# EAGLE design 12_lead_ecg_prototype_1 (EAGLE 9.6.1)
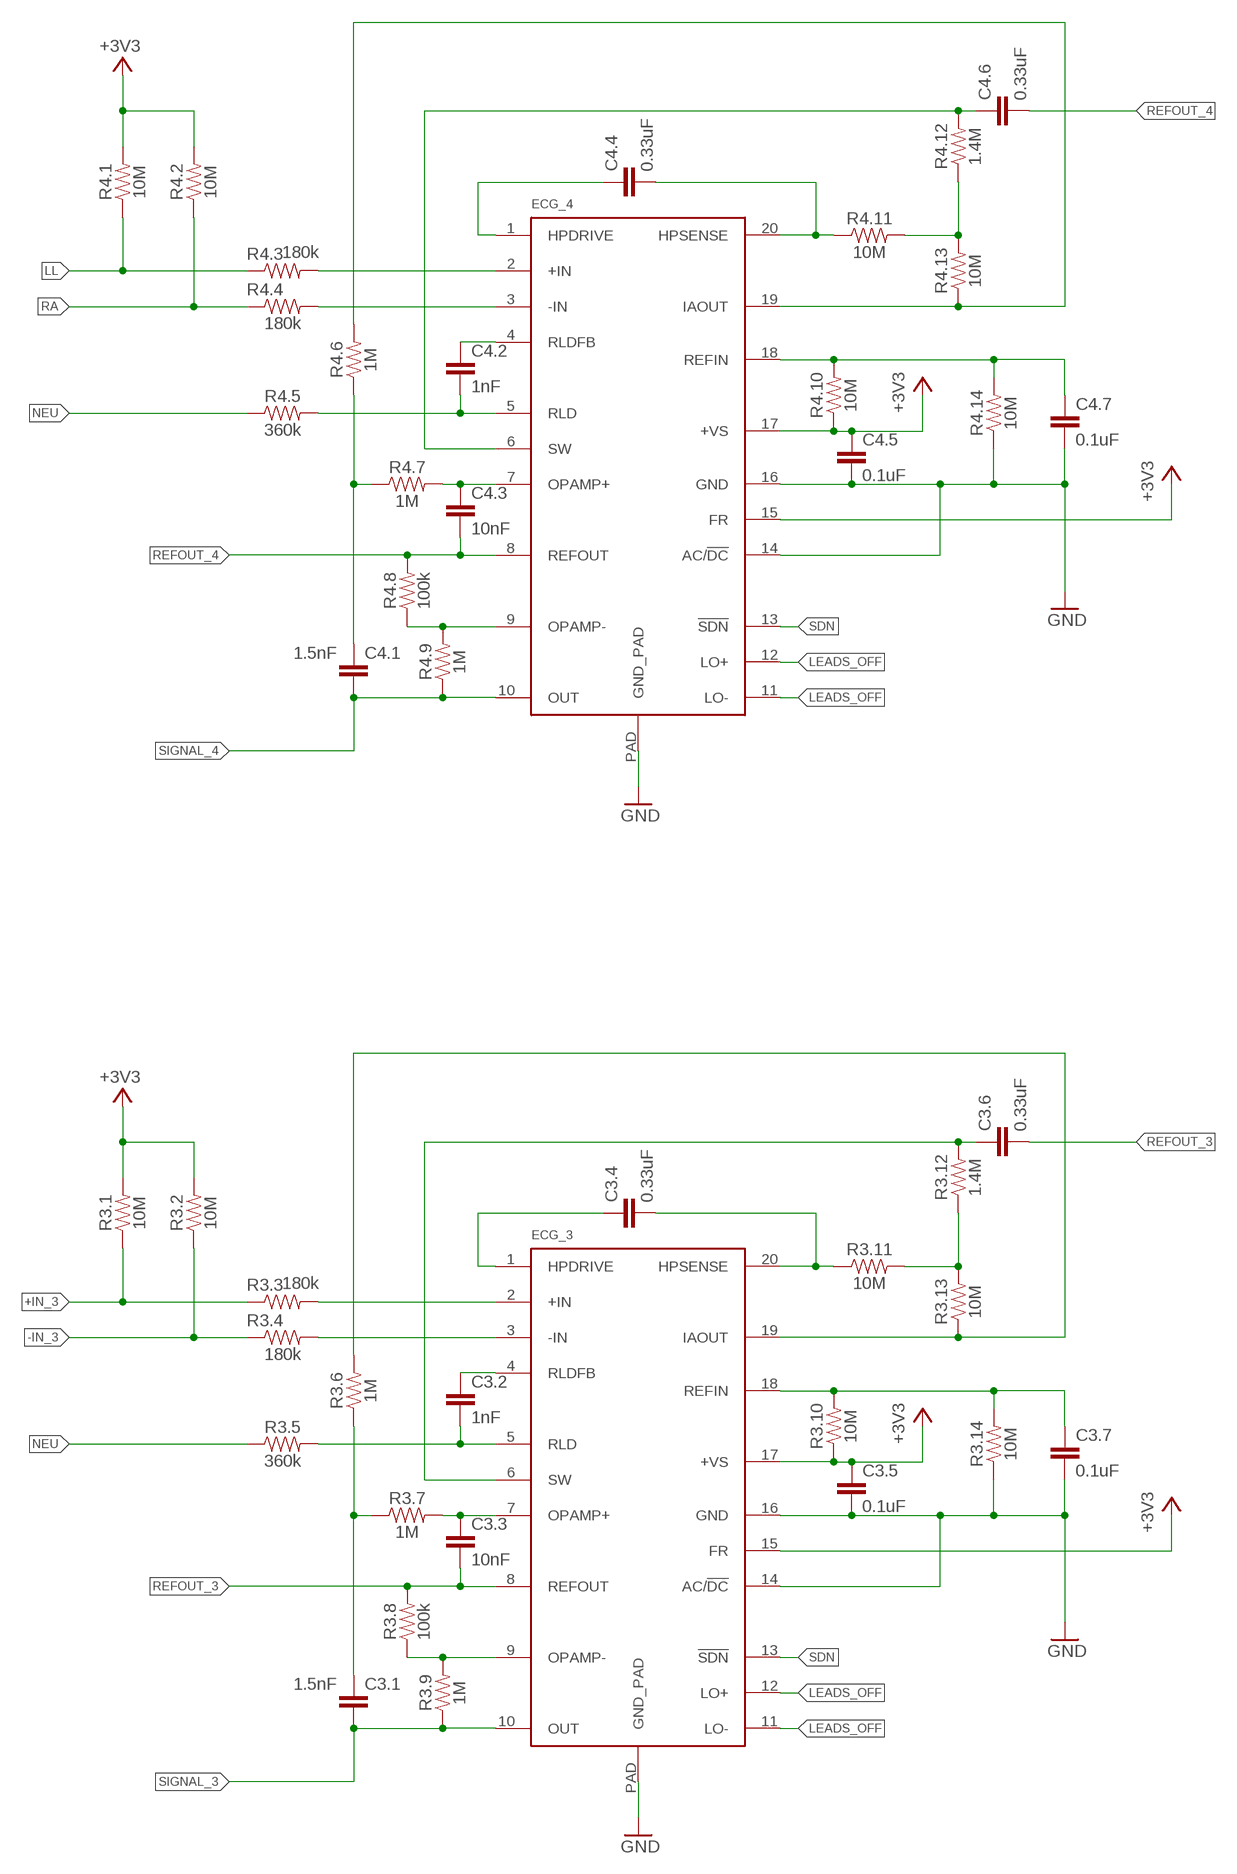
[diagram p0: schematic, sheet 1, part 1 of 2]
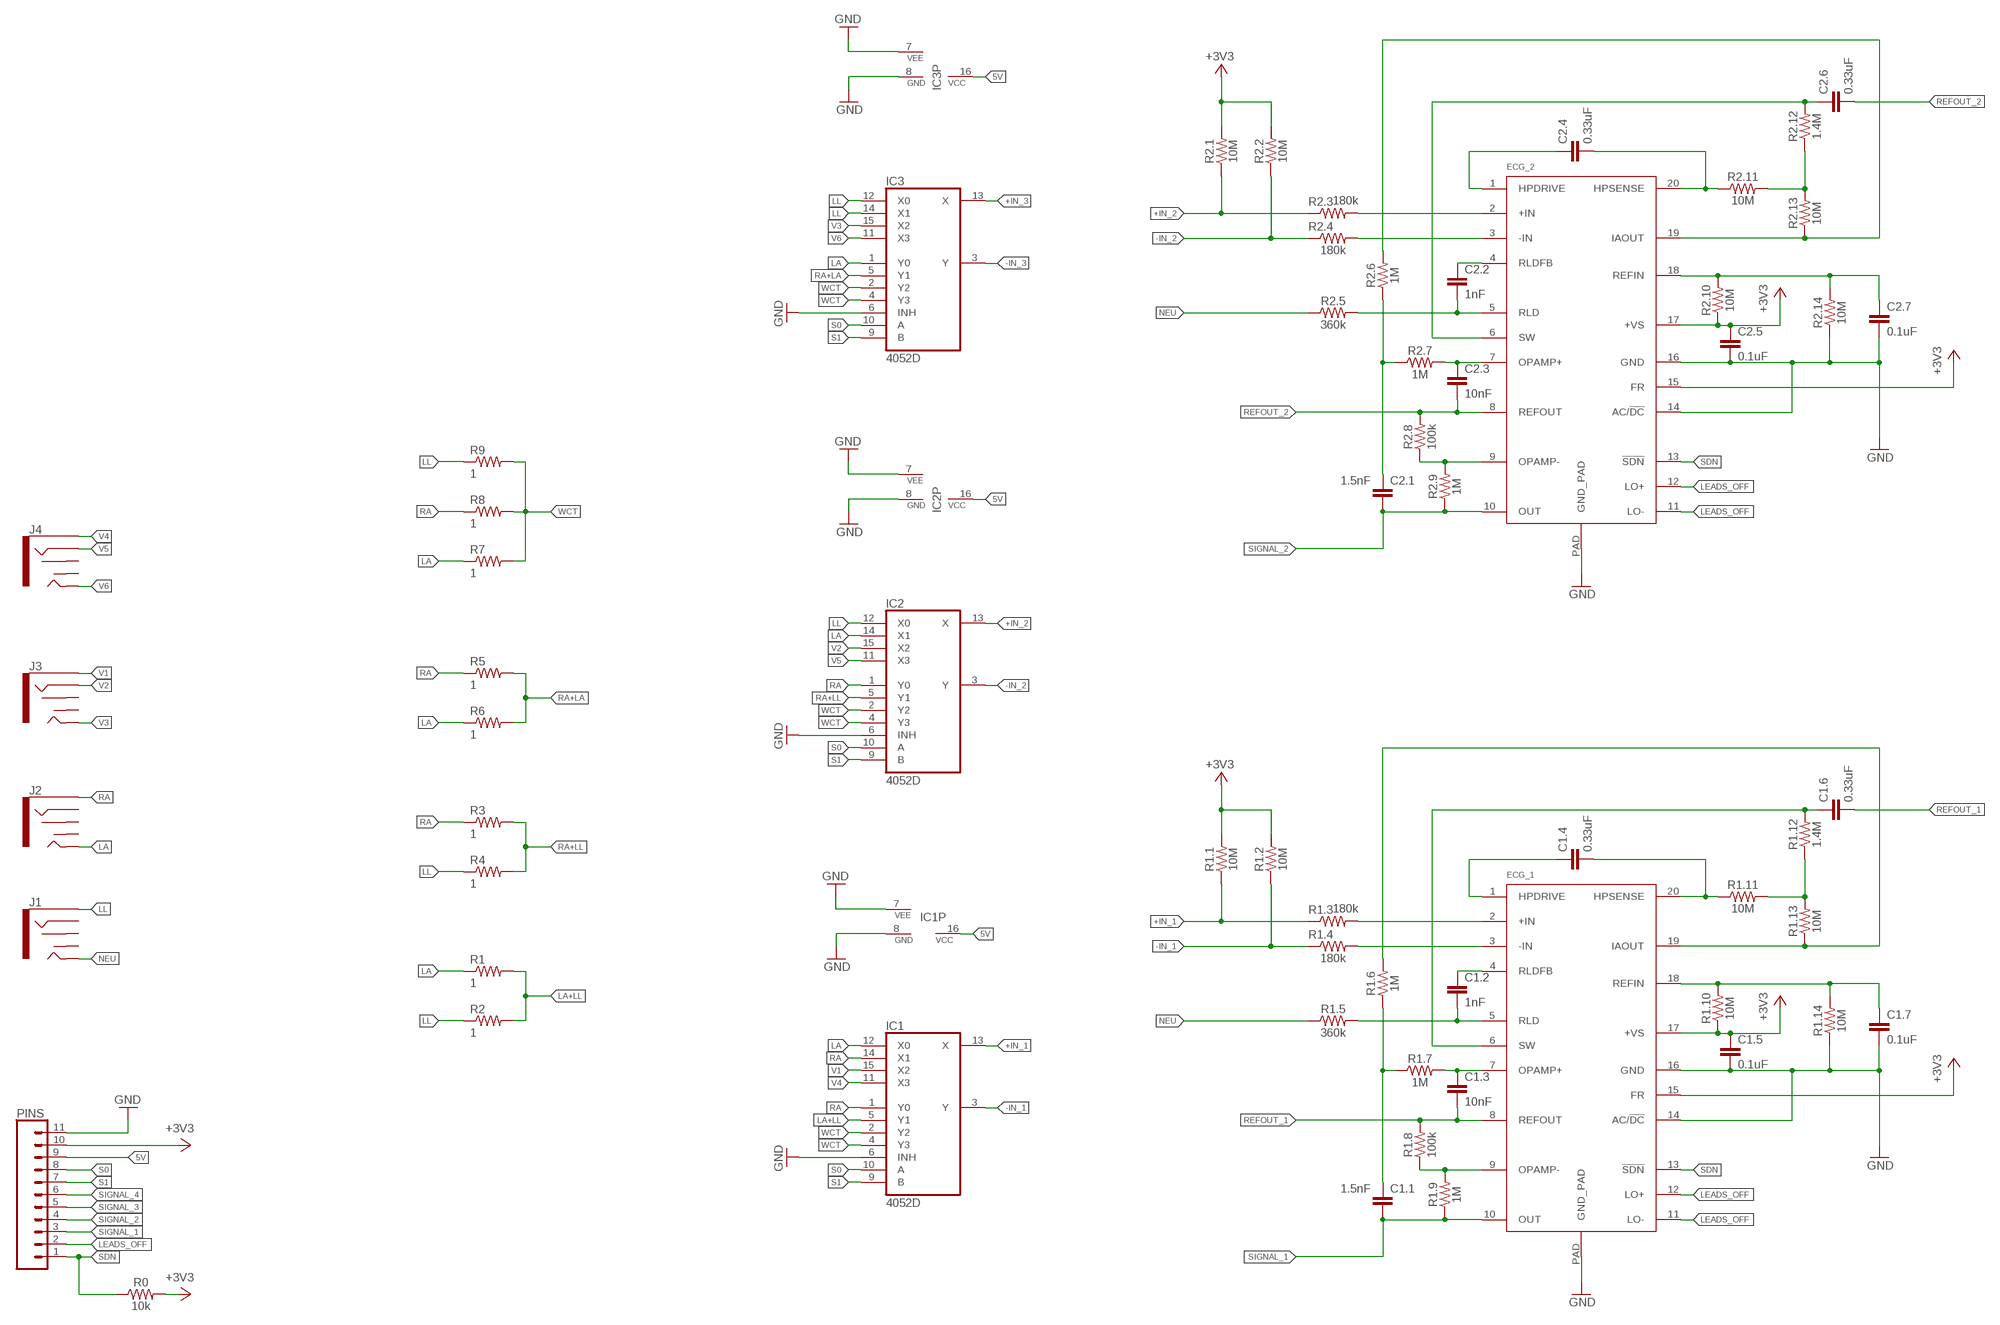
[diagram p1: schematic, sheet 1, part 2 of 2]

## Parts
C1.1  1.5nF  CAP0603-CAP  [0603-CAP]
C1.2  1nF  CAP0603-CAP  [0603-CAP]
C1.3  10nF  CAP0603-CAP  [0603-CAP]
C1.4  0.33uF  CAP0805  [0805]
C1.5  0.1uF  CAP0603-CAP  [0603-CAP]
C1.6  0.33uF  CAP0805  [0805]
C1.7  0.1uF  CAP0603-CAP  [0603-CAP]
C2.1  1.5nF  CAP0603-CAP  [0603-CAP]
C2.2  1nF  CAP0603-CAP  [0603-CAP]
C2.3  10nF  CAP0603-CAP  [0603-CAP]
C2.4  0.33uF  CAP0805  [0805]
C2.5  0.1uF  CAP0603-CAP  [0603-CAP]
C2.6  0.33uF  CAP0805  [0805]
C2.7  0.1uF  CAP0603-CAP  [0603-CAP]
C3.1  1.5nF  CAP0603-CAP  [0603-CAP]
C3.2  1nF  CAP0603-CAP  [0603-CAP]
C3.3  10nF  CAP0603-CAP  [0603-CAP]
C3.4  0.33uF  CAP0805  [0805]
C3.5  0.1uF  CAP0603-CAP  [0603-CAP]
C3.6  0.33uF  CAP0805  [0805]
C3.7  0.1uF  CAP0603-CAP  [0603-CAP]
C4.1  1.5nF  CAP0603-CAP  [0603-CAP]
C4.2  1nF  CAP0603-CAP  [0603-CAP]
C4.3  10nF  CAP0603-CAP  [0603-CAP]
C4.4  0.33uF  CAP0805  [0805]
C4.5  0.1uF  CAP0603-CAP  [0603-CAP]
C4.6  0.33uF  CAP0805  [0805]
C4.7  0.1uF  CAP0603-CAP  [0603-CAP]
ECG_1  AD8232ACPZ-R7  AD8232  [LFCSP_20]
ECG_2  AD8232ACPZ-R7  AD8232  [LFCSP_20]
ECG_3  AD8232ACPZ-R7  AD8232  [LFCSP_20]
ECG_4  AD8232ACPZ-R7  AD8232  [LFCSP_20]
IC1  4052D  [SO16]
IC2  4052D  [SO16]
IC3  4052D  [SO16]
J1  AUDIO_JACK_3.5MM_SMD  [AUDIO-JACK-3.5MM-SMD]
J2  AUDIO_JACK_3.5MM_SMD  [AUDIO-JACK-3.5MM-SMD]
J3  AUDIO_JACK_3.5MM_SMD  [AUDIO-JACK-3.5MM-SMD]
J4  AUDIO_JACK_3.5MM_SMD  [AUDIO-JACK-3.5MM-SMD]
PINS  CONN_11  [1X11]
R0  10k  10KOHM-0603-1/10W-1%  [0603]
R1  1  RESISTOR0402-RES  [0402-RES]
R1.1  10M  RESISTOR0603  [0603]
R1.2  10M  RESISTOR0603  [0603]
R1.3  180k  RESISTOR0603  [0603]
R1.4  180k  RESISTOR0603  [0603]
R1.5  360k  RESISTOR0603  [0603]
R1.6  1M  RESISTOR0603  [0603]
R1.7  1M  RESISTOR0603  [0603]
R1.8  100k  RESISTOR0603  [0603]
R1.9  1M  RESISTOR0603  [0603]
R1.10  10M  RESISTOR0603  [0603]
R1.11  10M  RESISTOR0603  [0603]
R1.12  1.4M  RESISTOR0603  [0603]
R1.13  10M  RESISTOR0603  [0603]
R1.14  10M  RESISTOR0603  [0603]
R2  1  RESISTOR0402-RES  [0402-RES]
R2.1  10M  RESISTOR0603  [0603]
R2.2  10M  RESISTOR0603  [0603]
R2.3  180k  RESISTOR0603  [0603]
R2.4  180k  RESISTOR0603  [0603]
R2.5  360k  RESISTOR0603  [0603]
R2.6  1M  RESISTOR0603  [0603]
R2.7  1M  RESISTOR0603  [0603]
R2.8  100k  RESISTOR0603  [0603]
R2.9  1M  RESISTOR0603  [0603]
R2.10  10M  RESISTOR0603  [0603]
R2.11  10M  RESISTOR0603  [0603]
R2.12  1.4M  RESISTOR0603  [0603]
R2.13  10M  RESISTOR0603  [0603]
R2.14  10M  RESISTOR0603  [0603]
R3  1  RESISTOR0402-RES  [0402-RES]
R3.1  10M  RESISTOR0603  [0603]
R3.2  10M  RESISTOR0603  [0603]
R3.3  180k  RESISTOR0603  [0603]
R3.4  180k  RESISTOR0603  [0603]
R3.5  360k  RESISTOR0603  [0603]
R3.6  1M  RESISTOR0603  [0603]
R3.7  1M  RESISTOR0603  [0603]
R3.8  100k  RESISTOR0603  [0603]
R3.9  1M  RESISTOR0603  [0603]
R3.10  10M  RESISTOR0603  [0603]
R3.11  10M  RESISTOR0603  [0603]
R3.12  1.4M  RESISTOR0603  [0603]
R3.13  10M  RESISTOR0603  [0603]
R3.14  10M  RESISTOR0603  [0603]
R4  1  RESISTOR0402-RES  [0402-RES]
R4.1  10M  RESISTOR0603  [0603]
R4.2  10M  RESISTOR0603  [0603]
R4.3  180k  RESISTOR0603  [0603]
R4.4  180k  RESISTOR0603  [0603]
R4.5  360k  RESISTOR0603  [0603]
R4.6  1M  RESISTOR0603  [0603]
R4.7  1M  RESISTOR0603  [0603]
R4.8  100k  RESISTOR0603  [0603]
R4.9  1M  RESISTOR0603  [0603]
R4.10  10M  RESISTOR0603  [0603]
R4.11  10M  RESISTOR0603  [0603]
R4.12  1.4M  RESISTOR0603  [0603]
R4.13  10M  RESISTOR0603  [0603]
R4.14  10M  RESISTOR0603  [0603]
R5  1  RESISTOR0402-RES  [0402-RES]
R6  1  RESISTOR0402-RES  [0402-RES]
R7  1  RESISTOR0402-RES  [0402-RES]
R8  1  RESISTOR0402-RES  [0402-RES]
R9  1  RESISTOR0402-RES  [0402-RES]

## Nets
5V: IC1.16(VCC) IC2.16(VCC) IC3.16(VCC) PINS.9
+3V3: C1.5.1 C2.5.1 C3.5.1 C4.5.1 ECG_1.15(FR) ECG_1.17(+VS) ECG_2.15(FR) ECG_2.17(+VS) ECG_3.15(FR) ECG_3.17(+VS) ECG_4.15(FR) ECG_4.17(+VS) PINS.10 R0.2 R1.1.2 R1.2.2 R1.10.1 R2.1.2 R2.2.2 R2.10.1 R3.1.2 R3.2.2 R3.10.1 R4.1.2 R4.2.2 R4.10.1
+IN_1: IC1.13(X) R1.1.1 R1.3.1
+IN_2: IC2.13(X) R2.1.1 R2.3.1
+IN_3: IC3.13(X) R3.1.1 R3.3.1
-IN_1: IC1.3(Y) R1.2.1 R1.4.1
-IN_2: IC2.3(Y) R2.2.1 R2.4.1
-IN_3: IC3.3(Y) R3.2.1 R3.4.1
GND: C1.5.2 C1.7.2 C2.5.2 C2.7.2 C3.5.2 C3.7.2 C4.5.2 C4.7.2 ECG_1.14(AC/!DC) ECG_1.16(GND) ECG_1.PAD(GND_PAD) ECG_2.14(AC/!DC) ECG_2.16(GND) ECG_2.PAD(GND_PAD) ECG_3.14(AC/!DC) ECG_3.16(GND) ECG_3.PAD(GND_PAD) ECG_4.14(AC/!DC) ECG_4.16(GND) ECG_4.PAD(GND_PAD) IC1.6(INH) IC1.7(VEE) IC1.8(GND) IC2.6(INH) IC2.7(VEE) IC3.6(INH) IC3.7(VEE) PINS.11 R1.14.1 R2.14.1 R3.14.1 R4.14.1
LA: IC1.12(X0) IC2.14(X1) IC3.1(Y0) J2.TIP R1.1 R6.1 R7.1
LA+LL: IC1.5(Y1) R1.2 R2.2
LEADS_OFF: ECG_1.11(LO-) ECG_1.12(LO+) ECG_2.11(LO-) ECG_2.12(LO+) ECG_3.11(LO-) ECG_3.12(LO+) ECG_4.11(LO-) ECG_4.12(LO+) PINS.2
LL: IC2.12(X0) IC3.12(X0) IC3.14(X1) J1.SLEEVE R2.1 R4.1 R4.1.1 R4.3.1 R9.1
N$1: ECG_1.9(OPAMP-) R1.8.1 R1.9.2
N$2: ECG_2.2(+IN) R2.3.2
N$3: ECG_1.2(+IN) R1.3.2
N$4: ECG_1.3(-IN) R1.4.2
N$5: ECG_2.3(-IN) R2.4.2
N$6: C1.1.1 R1.6.1 R1.7.1
N$7: C1.3.1 ECG_1.7(OPAMP+) R1.7.2
N$8: C1.2.1 ECG_1.4(RLDFB)
N$9: C1.2.2 ECG_1.5(RLD) R1.5.2
N$10: ECG_1.19(IAOUT) R1.6.2 R1.13.1
N$11: C1.6.1 ECG_1.6(SW) R1.12.2
N$12: C1.7.1 ECG_1.18(REFIN) R1.10.2 R1.14.2
N$13: R1.11.2 R1.12.1 R1.13.2
N$14: C1.4.2 ECG_1.20(HPSENSE) R1.11.1
N$15: C1.4.1 ECG_1.1(HPDRIVE)
N$16: C2.2.1 ECG_2.4(RLDFB)
N$17: C2.2.2 ECG_2.5(RLD) R2.5.2
N$18: IC2.8(GND) IC3.8(GND) ; supply symbol labelled GND
N$19: C2.1.1 R2.6.1 R2.7.1
N$20: C2.3.1 ECG_2.7(OPAMP+) R2.7.2
N$21: ECG_2.9(OPAMP-) R2.8.1 R2.9.2
N$22: ECG_2.19(IAOUT) R2.6.2 R2.13.1
N$23: C2.6.1 ECG_2.6(SW) R2.12.2
N$24: R2.11.2 R2.12.1 R2.13.2
N$25: C2.4.2 ECG_2.20(HPSENSE) R2.11.1
N$26: C2.4.1 ECG_2.1(HPDRIVE)
N$27: C2.7.1 ECG_2.18(REFIN) R2.10.2 R2.14.2
N$28: ECG_3.2(+IN) R3.3.2
N$29: ECG_3.3(-IN) R3.4.2
N$30: C3.2.1 ECG_3.4(RLDFB)
N$31: C3.2.2 ECG_3.5(RLD) R3.5.2
N$32: C3.1.1 R3.6.1 R3.7.1
N$33: C3.3.1 ECG_3.7(OPAMP+) R3.7.2
N$34: ECG_3.9(OPAMP-) R3.8.1 R3.9.2
N$35: ECG_3.19(IAOUT) R3.6.2 R3.13.1
N$36: C3.6.1 ECG_3.6(SW) R3.12.2
N$37: R3.11.2 R3.12.1 R3.13.2
N$38: C3.4.2 ECG_3.20(HPSENSE) R3.11.1
N$39: C3.4.1 ECG_3.1(HPDRIVE)
N$40: C3.7.1 ECG_3.18(REFIN) R3.10.2 R3.14.2
N$41: ECG_4.2(+IN) R4.3.2
N$42: ECG_4.3(-IN) R4.4.2
N$43: C4.2.1 ECG_4.4(RLDFB)
N$44: C4.2.2 ECG_4.5(RLD) R4.5.2
N$45: C4.1.1 R4.6.1 R4.7.1
N$46: C4.3.1 ECG_4.7(OPAMP+) R4.7.2
N$47: ECG_4.9(OPAMP-) R4.8.1 R4.9.2
N$48: ECG_4.19(IAOUT) R4.6.2 R4.13.1
N$49: C4.6.1 ECG_4.6(SW) R4.12.2
N$50: R4.11.2 R4.12.1 R4.13.2
N$51: C4.4.2 ECG_4.20(HPSENSE) R4.11.1
N$52: C4.4.1 ECG_4.1(HPDRIVE)
N$53: C4.7.1 ECG_4.18(REFIN) R4.10.2 R4.14.2
NEU: J1.TIP R1.5.1 R2.5.1 R3.5.1 R4.5.1
RA: IC1.1(Y0) IC1.14(X1) IC2.1(Y0) J2.SLEEVE R3.1 R4.2.1 R4.4.1 R5.1 R8.1
RA+LA: IC3.5(Y1) R5.2 R6.2
RA+LL: IC2.5(Y1) R3.2 R4.2
REFOUT_1: C1.3.2 C1.6.2 ECG_1.8(REFOUT) R1.8.2
REFOUT_2: C2.3.2 C2.6.2 ECG_2.8(REFOUT) R2.8.2
REFOUT_3: C3.3.2 C3.6.2 ECG_3.8(REFOUT) R3.8.2
REFOUT_4: C4.3.2 C4.6.2 ECG_4.8(REFOUT) R4.8.2
S0: IC1.10(A) IC2.10(A) IC3.10(A) PINS.8
S1: IC1.9(B) IC2.9(B) IC3.9(B) PINS.7
SDN: ECG_1.13(!SDN) ECG_2.13(!SDN) ECG_3.13(!SDN) ECG_4.13(!SDN) PINS.1 R0.1
SIGNAL_1: C1.1.2 ECG_1.10(OUT) PINS.3 R1.9.1
SIGNAL_2: C2.1.2 ECG_2.10(OUT) PINS.4 R2.9.1
SIGNAL_3: C3.1.2 ECG_3.10(OUT) PINS.5 R3.9.1
SIGNAL_4: C4.1.2 ECG_4.10(OUT) PINS.6 R4.9.1
V1: IC1.15(X2) J3.SLEEVE
V2: IC2.15(X2) J3.RING
V3: IC3.15(X2) J3.TIP
V4: IC1.11(X3) J4.SLEEVE
V5: IC2.11(X3) J4.RING
V6: IC3.11(X3) J4.TIP
WCT: IC1.2(Y2) IC1.4(Y3) IC2.2(Y2) IC2.4(Y3) IC3.2(Y2) IC3.4(Y3) R7.2 R8.2 R9.2
Unconnected: J1.RING J1.RSH J1.TSH J2.RING J2.RSH J2.TSH J3.RSH J3.TSH J4.RSH J4.TSH

## Library data of the parts
C1.1-C1.7 C2.1-C2.7 C3.1-C3.7 C4.1-C4.7 = SparkFun-Passives:CAP: Capacitor Standard 0603 ceramic capacitor, and 0.1" leaded capacitor.
ECG_1-ECG_4 = SparkFun-Sensors:AD8232: AD8232 Single Lead Heart Rate Monitor IC Datasheet <https://cdn.sparkfun.com/datasheets/Sensors/Biometric/AD8232.pdf> SparkFun Products SparkFun Single Lead Heart Rate Monitor - AD8232 <https://www.sparkfun.com/products/12650> (SEN-12650); PROD_ID: IC-11886
IC1-IC3 = 40xx:4052: Dual 4-channel ANALOG MULTIPLEXER
J1-J4 = SparkFun-Connectors:AUDIO_JACK_3.5MM: Audio Jack 3.5mm variants of PTH and SMT stereo audio jack with bypass switches. SparkFun Products: SparkFun SparkPunk Sound Kit <[https://www.sparkfun.com/products/11177]> - PTH MP3 Trigger <https://www.sparkfun.com/products/13720> -3.5mm SMD SparkFun PicoBoard <https://www.sparkfun.com/products/11888>- 2.5mm SMD; PROD_ID: CONN-10353
PINS = SparkFun-Connectors:CONN_11: Multi connection point. Often used as Generic Header-pin footprint for 0.1 inch spaced/style header connections On any of the 0.1 inch spaced packages, you can populate with these: Break Away Headers - Straight <https://www.sparkfun.com/products/116> (PRT-00116) Break Away Male Headers - Right Angle <https://www.sparkfun.com/products/553> (PRT-00553) Female Headers <https://www.sparkfun.com/products/115> (PRT-00115) Break Away Headers - Machine Pin <https://www.sparkfun.com/products/117> (PRT-00117) Break Away Female Headers - Swiss Machine Pin <https://www.sparkfun.com/products/743> (PRT-00743) For SCREWTERMINALS and SPRING TERMINALS visit here: Screw Terimnals on SparkFun.com <https://www.sparkfun.com/search/results?term=Screw+Terminals> (5mm/3.5mm/2.54mm spacing) This device is also useful as a general connection point to wire up your design to another part of your project. Our various solder wires solder well into these plated through hole pads. Hook-Up Wire - Assortment (Stranded, 22 AWG) <https://www.sparkfun.com/products/11375> (PRT-11375) Hook-Up Wire - Assortment (Solid Core, 22 AWG) <https://www.sparkfun.com/products/11367> (PRT-11367) View the entire wire category on our website here <https://www.sparkfun.com/categories/141>
R0 = SparkFun-Resistors:10KOHM: 10kΩ resistor A resistor is a passive two-terminal electrical component that implements electrical resistance as a circuit element. Resistors act to reduce current flow, and, at the same time, act to lower voltage levels within circuits. - Wikipedia; PROD_ID: RES-00824
R1-R9 = SparkFun:RESISTOR: Resistor Basic schematic elements and footprints for 0603, 1206, and PTH resistors.
R1.1-R1.14 R2.1-R2.14 R3.1-R3.14 R4.1-R4.14 = SparkFun-Resistors:RESISTOR: Generic Resistor Package

## Board
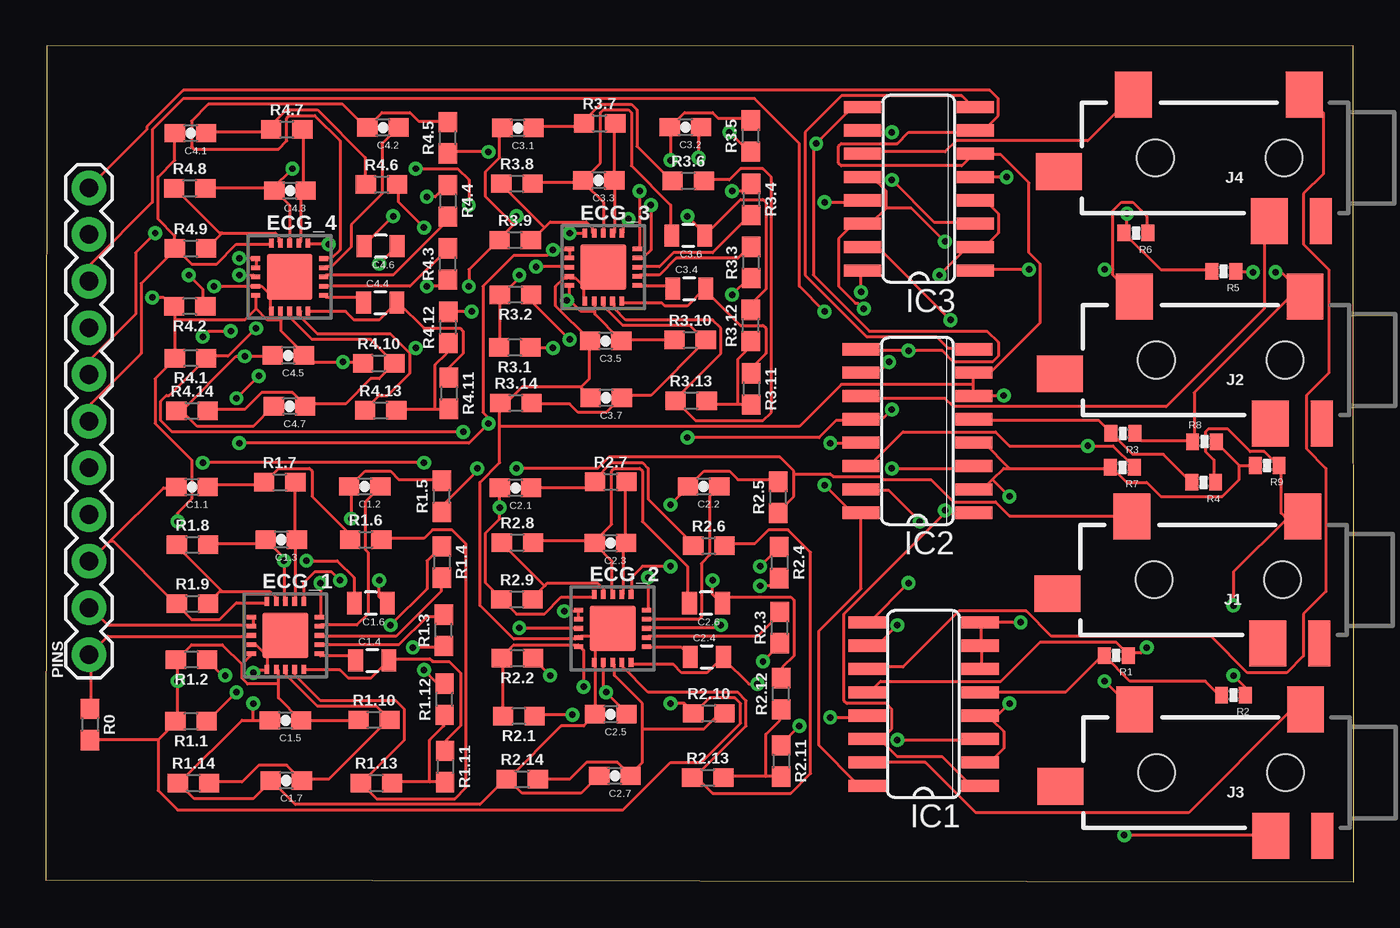
[diagram p2: board, top side]
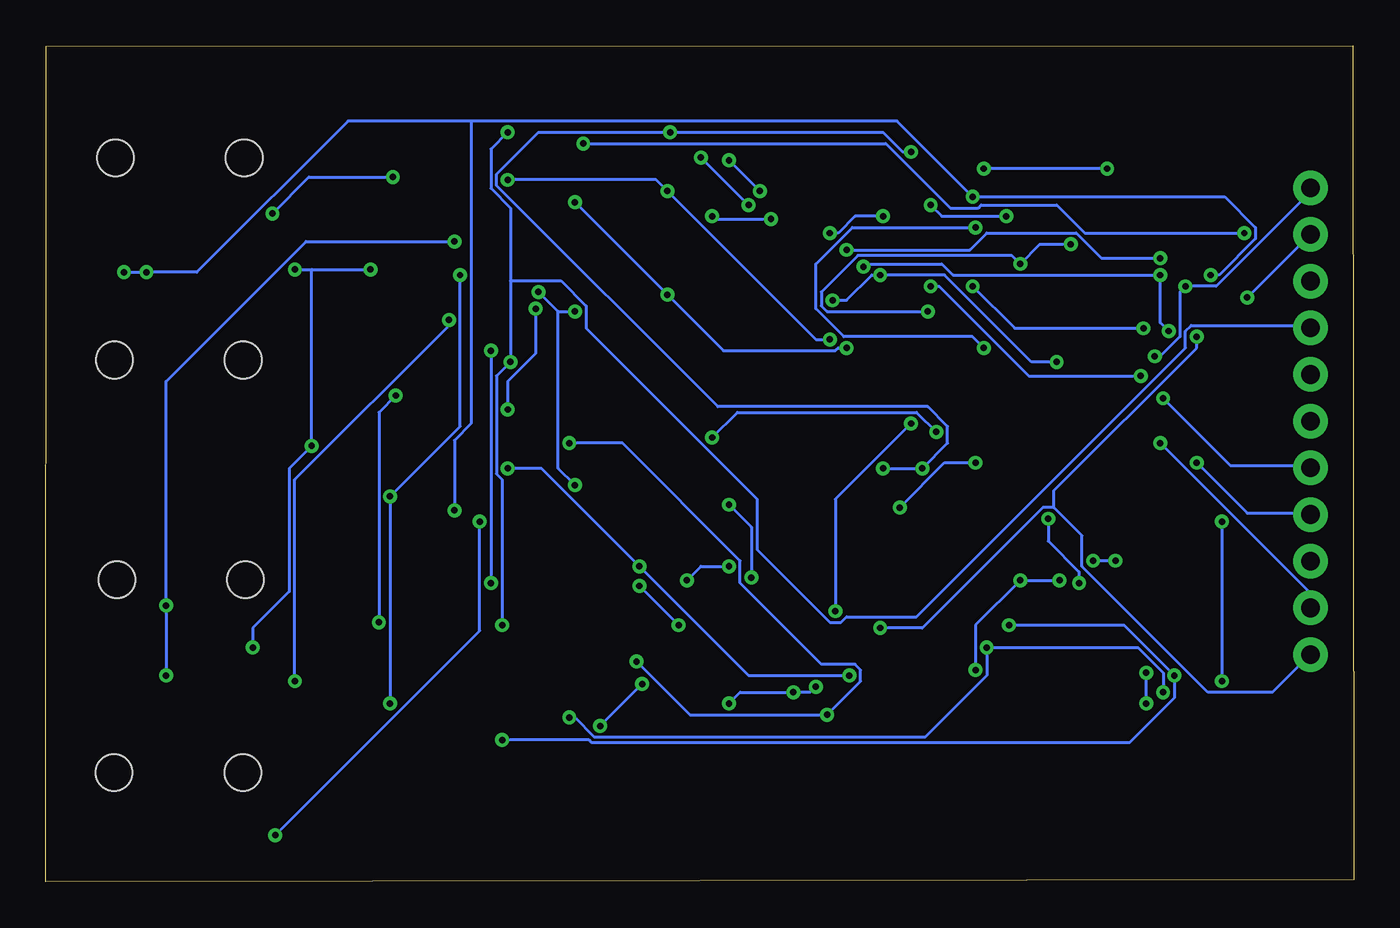
[diagram p3: board, bottom side, seen from below]

Size 71.15 x 45.49 mm. Coordinates in mm from the lower left corner, seen from the top.
Outline: 0,0.1 71.15,0 71.12,45.47 0.05,45.49 0,0.1
Copper layers (1*16): Top 0.035mm / dielectric 1.5mm / Bottom 0.035mm
Design rules "default": minimum track width 6mil, minimum drill 0.35mm, track to track 6mil, track to pad 6mil, pad to pad 6mil, via to via 6mil, smd to smd 6mil, copper to edge 40mil, drill to drill 6mil, minimum pad ring 10mil, minimum via ring 8mil, stop-mask expansion 4mil, vias tented up to drill 0mil, thermal gap 10mil

### Footprints (pad centres in the part's own frame; a part is rotated, then mirrored left to right if it is on the bottom)
0603-CAP = smd 1.1 x 1: 1 -0.85,0; 2 0.85,0
0805 = smd 0.8 x 1.2: 1 -0.9,0; 2 0.9,0
LFCSP_20 = smd 0.5 x 0.25: 1 -1.85,1; 2 -1.85,0.5; 3 -1.85,0; 4 -1.85,-0.5; 5 -1.85,-1; 11 1.85,-1; 12 1.85,-0.5; 13 1.85,0; 14 1.85,0.5; 15 1.85,1 | smd 0.25 x 0.5: 6 -1,-1.85; 7 -0.5,-1.85; 8 0,-1.85; 9 0.5,-1.85; 10 1,-1.85; 16 1,1.85; 17 0.5,1.85; 18 0,1.85; 19 -0.5,1.85; 20 -1,1.85 | smd 2.5 x 2.5: PAD 0,0
SO16 = smd 0.66 x 2.032: 1 -4.445,-3.073; 2 -3.175,-3.073; 3 -1.905,-3.073; 4 -0.635,-3.073; 5 0.635,-3.073; 6 1.905,-3.073; 7 3.175,-3.073; 8 4.445,-3.073; 9 4.445,3.073; 10 3.175,3.073; 11 1.905,3.073; 12 0.635,3.073; 13 -0.635,3.073; 14 -1.905,3.073; 15 -3.175,3.073; 16 -4.445,3.073
AUDIO-JACK-3.5MM-SMD = smd 2 x 2.5: RING 4.3,3.45; SLEEVE 2.4,-3.45; TIP 11.7,-3.45 | smd 1.2 x 2.5: RSH 1.5,3.45 | smd 2.5 x 2: TSH 15.75,0.75 | hole 2: 3.5,0; 10.5,0
1X11 = drill 1.016 pad 1.88: 1 0,0; 2 2.54,0; 3 5.08,0; 4 7.62,0; 5 10.16,0; 6 12.7,0; 7 15.24,0; 8 17.78,0; 9 20.32,0; 10 22.86,0; 11 25.4,0
0603 = smd 1.1 x 1: 1 -0.85,0; 2 0.85,0
0402-RES = smd 0.7 x 0.9: 1 -0.65,0; 2 0.65,0

### Placement (x,y rotation side)
C1.1  7.95,21.49 180 top
C1.2  17.35,21.51 180 top
C1.3  12.8,18.62 180 top
C1.4  17.75,12.04 0 top
C1.5  13.03,8.79 180 top
C1.6  17.68,15.16 180 top
C1.7  13.08,5.51 180 top
C2.1  25.55,21.44 180 top
C2.2  35.79,21.51 180 top
C2.3  30.71,18.44 180 top
C2.4  35.97,12.24 0 top
C2.5  30.73,9.12 180 top
C2.6  35.92,15.16 180 top
C2.7  30.96,5.77 180 top
C3.1  25.68,41.02 180 top
C3.2  34.8,41.07 180 top
C3.3  30.07,38.18 180 top
C3.4  35,32.28 0 top
C3.5  30.45,29.44 180 top
C3.6  34.95,35.18 180 top
C3.7  30.48,26.34 180 top
C4.1  7.87,40.74 180 top
C4.2  18.34,41.05 180 top
C4.3  13.28,37.62 180 top
C4.4  18.19,31.52 0 top
C4.5  13.18,28.65 180 top
C4.6  18.21,34.59 180 top
C4.7  13.26,25.88 180 top
ECG_1  13.03,13.41 180 top
ECG_2  30.84,13.79 180 top
ECG_3  30.33,33.45 180 top
ECG_4  13.26,32.92 180 top
IC1  47.75,9.68 90 top
IC2  47.42,24.54 90 top
IC3  47.5,37.72 90 top
J1  70.79,16.43 180 top
J2  70.92,28.4 180 top
J3  70.94,5.94 180 top
J4  70.87,39.4 180 top
PINS  2.34,12.37 90 top
R0  2.39,8.56 270 top
R1  58.24,12.32 180 top
R1.1  7.9,8.74 180 top
R1.2  7.92,12.09 180 top
R1.3  21.64,13.69 90 top
R1.4  21.54,17.4 270 top
R1.5  21.54,20.98 90 top
R1.6  17.4,18.62 0 top
R1.7  12.73,21.74 0 top
R1.8  7.98,18.34 0 top
R1.9  7.98,15.14 0 top
R1.10  17.86,8.81 0 top
R1.11  21.72,6.27 270 top
R1.12  21.69,9.93 90 top
R1.13  17.98,5.38 0 top
R1.14  8.03,5.38 0 top
R2  64.62,10.16 180 top
R2.1  25.73,9.02 180 top
R2.2  25.65,12.17 180 top
R2.3  39.93,13.84 90 top
R2.4  39.9,17.37 270 top
R2.5  39.85,20.93 90 top
R2.6  36.07,18.29 0 top
R2.7  30.73,21.77 0 top
R2.8  25.65,18.47 0 top
R2.9  25.63,15.37 0 top
R2.10  36.07,9.17 0 top
R2.11  40.01,6.58 270 top
R2.12  40.01,10.24 90 top
R2.13  36.02,5.66 0 top
R2.14  25.91,5.59 0 top
R3  58.6,24.41 180 top
R3.1  25.5,29.08 180 top
R3.2  25.55,31.95 180 top
R3.3  38.38,33.71 90 top
R3.4  38.38,37.13 270 top
R3.5  38.35,40.59 90 top
R3.6  34.95,38.15 0 top
R3.7  30.12,41.27 0 top
R3.8  25.63,38 0 top
R3.9  25.53,34.92 0 top
R3.10  35.05,29.49 0 top
R3.11  38.38,26.82 270 top
R3.12  38.35,30.28 90 top
R3.13  35.1,26.19 0 top
R3.14  25.58,26.06 0 top
R4  62.99,21.74 180 top
R4.1  7.87,28.5 180 top
R4.2  7.82,31.32 180 top
R4.3  21.87,33.63 90 top
R4.4  21.87,37.06 270 top
R4.5  21.87,40.49 90 top
R4.6  18.26,37.95 0 top
R4.7  13.11,40.94 0 top
R4.8  7.82,37.74 0 top
R4.9  7.87,34.47 0 top
R4.10  18.11,28.22 0 top
R4.11  21.92,26.59 270 top
R4.12  21.89,30.18 90 top
R4.13  18.21,25.65 0 top
R4.14  7.95,25.63 0 top
R5  64.08,33.22 180 top
R6  59.31,35.31 180 top
R7  58.57,22.56 180 top
R8  63.04,23.95 0 top
R9  66.45,22.66 180 top

### Tracks (layer width: path | path; a pad name or v marks a point on that pad's centre or on a via)
5V  (via drill 0.35)
  Top 0.152: IC1.16 44.65,5.28 44.2,5.28 42.06,7.42 42.06,13.67 44.35,15.95 IC2.16 44.35,20.22 43.74,20.22 v42.37,21.59 | v44.35,32.11 44.35,33.17 IC3.16 | v42.37,31.04 41,32.41 41,40.18 38.56,42.62 7.47,42.62 5.79,40.94 5.79,36.98 2.44,33.63 2.44,32.72 PINS.9
  Bottom 0.152: 43.28,31.04 v44.35,32.11 | 43.28,31.04 43.28,22.5 v42.37,21.59 | 43.28,31.04 v42.37,31.04
+3V3  (via drill 0.35)
  Top 0.152: ECG_2.17 30.33,11.84 30.33,10.46 v30.48,10.31 31.55,9.25 C2.5.1 | R2.1.2 24.84,9.09 24.84,12.14 R2.2.2 24.84,12.29 25.45,12.9 28.96,12.9 ECG_2.15 29.11,12.75 29.26,12.6 v29.26,10.62 | 12.65,10.77 12.65,10.01 13.87,8.79 C1.5.1 16.92,8.79 R1.10.1 | 12.65,10.77 12.65,11.53 ECG_1.17 | 10.67,11.84 11.12,12.29 ECG_1.15 | 10.67,11.84 10.67,11.07 10.97,10.77 12.65,10.77 | 6.1,7.72 2.44,7.72 R0.2 | 6.1,7.72 7.01,8.64 R1.1.2 7.16,8.79 v7.16,10.92 7.16,11.99 R1.2.2 7.16,12.14 7.92,12.9 9.6,12.9 10.67,11.84 | 6.1,7.72 6.1,4.98 7.16,3.91 31.39,3.91 33.98,6.5 35.66,6.5 37.8,8.64 37.8,9.7 37.49,10.01 36.12,10.01 35.36,9.25 R2.10.1 35.2,9.25 34.75,9.7 v33.98,9.7 | R3.1.2 24.69,29.21 R3.2.2 24.84,31.95 25.76,32.87 v25.76,33.02 | 29.87,31.04 29.87,30.89 31.24,29.51 C3.5.1 31.39,29.51 34.14,29.51 R3.10.1 | 29.87,31.04 29.87,31.5 ECG_3.17 | 28.5,31.65 28.5,32.41 ECG_3.15 | 28.5,31.65 29.11,31.04 29.87,31.04 | 28.5,31.65 v28.35,31.65 | 7.01,30.58 7.01,31.19 R4.2.2 6.86,31.34 6.4,31.8 v5.79,31.8 | 7.01,30.58 7.01,28.6 R4.1.2 7.01,28.45 5.94,27.38 5.94,24.94 7.92,22.96 7.92,20.83 7.16,20.07 v7.16,19.61 | 12.8,30.58 12.8,29.97 14.02,28.75 C4.5.1 14.17,28.6 14.48,28.3 v16.15,28.3 17.22,28.3 R4.10.1 | 12.8,30.58 12.8,31.04 ECG_4.17 | 11.43,31.19 11.43,31.8 ECG_4.15 | 11.43,31.19 12.04,30.58 12.8,30.58 | 7.01,30.58 10.82,30.58 11.43,31.19
  Bottom 0.152: v29.26,10.62 29.57,10.31 v30.48,10.31 33.38,10.31 v33.98,9.7 | v28.35,31.65 27.58,31.65 26.21,33.02 v25.76,33.02 22.25,33.02 17.53,28.3 v16.15,28.3 | v5.79,31.8 2.44,35.15 PINS.10 | v7.16,19.61 v7.16,10.92
+IN_1  (via drill 0.35)
  Top 0.152: v10.36,10.31 8.84,8.79 R1.1.1 | v19.96,12.75 21.64,12.75 R1.3.1 | v42.67,8.94 44.65,8.94 IC1.13
  Bottom 0.152: v10.36,10.31 10.36,11.38 11.73,12.75 v19.96,12.75 19.96,11.23 23.32,7.87 41.3,7.87 42.37,8.94 v42.67,8.94
+IN_2  (via drill 0.35)
  Top 0.152: v28.65,9.09 26.67,9.09 R2.1.1 | v39.01,11.99 39.93,12.9 R2.3.1 | v42.67,23.88 44.35,23.88 IC2.13
  Bottom 0.152: v39.01,11.99 36.12,9.09 v28.65,9.09 26.82,10.92 26.82,11.53 27.13,11.84 28.96,11.84 33.38,16.26 33.38,17.48 39.78,23.88 v42.67,23.88
+IN_3  (via drill 0.35)
  Top 0.152: v27.58,29.06 26.36,29.06 R3.1.1 | v37.34,31.95 38.25,32.87 R3.3.1 | v42.37,36.98 44.35,36.98 IC3.13
  Bottom 0.152: v27.58,29.06 28.04,29.06 28.19,28.91 34.29,28.91 v37.34,31.95 v42.37,36.98
-IN_1  (via drill 0.35)
  Top 0.152: v9.75,11.23 9.6,11.23 8.84,11.99 R1.2.1 | v18.75,13.97 20.73,15.95 20.73,17.48 21.49,18.24 R1.4.1 | v46.33,7.72 50.75,7.72 IC1.3
  Bottom 0.152: v18.75,13.97 12.5,13.97 v9.75,11.23 9.75,10.01 12.19,7.57 41.45,7.57 41.6,7.72 v46.33,7.72
-IN_2  (via drill 0.35)
  Top 0.152: v27.43,11.23 26.52,12.14 R2.2.1 | v38.86,17.17 39.78,18.08 R2.4.1 | v46.02,22.5 50.44,22.5 IC2.3
  Bottom 0.152: v27.43,11.23 32.92,11.23 v38.86,17.17 44.2,22.5 v46.02,22.5
-IN_3  (via drill 0.35)
  Top 0.152: v28.5,29.51 26.52,31.5 26.52,31.95 R3.2.1 | v37.34,37.59 37.95,37.59 38.25,37.9 R3.4.1 | v46.02,38.2 48.31,35.92 50.44,35.92 IC3.3
  Bottom 0.152: v28.5,29.51 29.26,29.51 v37.34,37.59 37.95,38.2 v46.02,38.2
GND  (via drill 0.35)
  Top 0.152: 12.04,12.29 12.04,11.68 ECG_1.16 12.04,11.53 11.43,11.53 v11.28,11.38 | 12.04,12.29 11.43,12.9 11.28,12.9 ECG_1.14 | 12.04,12.29 13.11,13.36 ECG_1.PAD | 11.28,8.79 10.67,8.79 7.32,5.44 R1.14.1 7.32,5.28 8.08,4.52 11.28,4.52 12.19,5.44 C1.7.2 12.34,5.44 13.56,4.22 23.62,4.22 24.99,5.59 R2.14.1 25.15,5.59 | 11.28,8.79 C1.5.2 | 11.28,8.79 v11.28,9.7 | 29.26,32.41 29.26,31.65 ECG_3.16 | 29.26,32.41 28.8,32.87 28.5,32.87 ECG_3.14 28.35,32.87 28.19,32.87 27.74,32.41 27.74,31.34 29.57,29.51 C3.5.2 29.57,29.36 29.57,27.38 29.11,26.92 | 29.26,32.41 30.33,33.48 ECG_3.PAD | 29.11,26.92 25.91,26.92 25.15,26.16 24.84,26.16 R3.14.1 24.69,26.01 24.69,24.79 | 29.11,26.92 29.57,26.47 C3.7.2 | 25.15,5.59 25.91,4.83 29.11,4.83 30.02,5.74 C2.7.2 | 29.87,13.36 30.48,13.36 30.79,13.67 ECG_2.PAD 29.87,13.36 | 29.87,13.36 29.11,13.36 ECG_2.14 28.96,13.36 28.8,13.21 25.45,13.21 23.62,15.04 23.62,21.74 24.69,22.81 24.69,24.79 | 29.87,13.36 29.87,11.99 ECG_2.16 29.87,11.84 29.87,9.25 C2.5.2 29.87,9.09 29.26,8.48 28.04,8.48 25.15,5.59 | 7.32,25.55 7.47,25.55 8.23,24.79 11.28,24.79 12.34,25.86 C4.7.2 | 7.32,25.55 7.16,25.55 R4.14.1 7.32,25.55 | 7.32,25.55 10.36,28.6 v10.82,28.6 12.19,28.6 C4.5.2 | 12.19,31.95 12.19,31.19 ECG_4.16 | 12.19,31.95 11.73,32.41 11.43,32.41 ECG_4.14 11.28,32.41 v9.14,32.41 | 12.19,31.95 13.26,33.02 ECG_4.PAD | IC1.6 50.9,11.68 50.9,12.75 IC1.7 50.9,12.9 50.9,14.12 | 50.44,27.08 50.44,27.69 IC2.7 50.6,27.84 51.51,27.84 54.1,30.43 54.1,33.63 53.49,34.24 53.49,38.05 51.97,39.57 50.6,39.57 IC3.6 50.44,39.57 49.84,38.96 43.28,38.96 43.13,39.12 43.13,40.03 43.28,40.18 46.33,40.18 46.94,40.79 50.44,40.79 IC3.7 50.6,40.94 51.05,40.94 51.82,41.71 51.82,42.62 51.36,43.08 7.47,43.08 5.49,41.1 5.49,40.94 2.44,37.9 PINS.11
  Top 0.152: 50.44,27.08 50.44,26.47 IC2.6 50.6,26.47 v52.12,26.47 | v53.03,14.12 50.9,14.12 | 50.9,14.12 IC1.8 | 24.69,24.79 41,24.79 43.28,27.08 50.44,27.08
  Bottom 0.152: v11.28,9.7 v11.28,11.38 | PINS.11 2.44,37.74 2.44,37.44 7.47,32.41 v9.14,32.41 9.45,32.11 9.45,29.67 10.52,28.6 v10.82,28.6 | v53.03,14.12 53.03,25.55 v52.12,26.47
LA  (via drill 0.35)
  Top 0.152: IC1.12 44.81,10.31 45.41,10.92 51.97,10.92 54.1,13.06 58.22,13.06 58.83,12.45 R1.1 58.98,12.45 59.59,12.45 v59.89,12.75 | 58.06,33.32 58.06,33.02 59.13,31.95 J2.TIP | 58.06,33.32 58.06,36.53 58.52,36.98 59.13,36.98 59.89,36.22 59.89,35.31 R6.1 | v53.49,33.32 50.6,33.32 IC3.1 | 58.06,33.32 v57.61,33.32 | R7.1 59.13,22.66 58.06,23.72 v56.69,23.72 52.43,23.72 51.66,24.49 46.63,24.49 44.81,22.66 44.35,22.66 IC2.14
  Bottom 0.152: v57.61,33.32 56.69,33.32 | 56.69,33.32 v53.49,33.32 | 56.69,33.32 v56.69,23.72 57.91,22.5 57.91,15.8 59.89,13.82 v59.89,12.75
LA+LL
  Top 0.152: R2.2 63.86,10.16 63.09,10.92 58.98,10.92 57.61,12.29 R1.2 57.45,12.29 55.47,10.31 IC1.5
LEADS_OFF  (via drill 0.35)
  Top 0.152: ECG_1.11 11.28,14.43 11.28,13.97 ECG_1.12 11.12,13.97 3.35,13.97 2.44,14.88 PINS.2 | 28.96,14.73 28.96,14.27 ECG_2.12 | ECG_4.12 11.43,33.48 11.43,33.93 ECG_4.11 11.28,33.93 v10.52,33.93 | ECG_3.12 28.5,33.93 28.5,34.39 ECG_3.11 28.35,34.39 v27.58,34.39 27.28,34.09 25.45,34.09 23.77,32.41 23.77,25.55 24.08,25.25 v24.08,24.94 23.01,23.88 v10.52,23.88 | v28.19,14.73 28.96,14.73 | 28.96,14.73 ECG_2.11
  Bottom 0.152: v10.52,33.93 13.72,33.93 15.09,35.31 19.96,35.31 20.88,34.39 v27.58,34.39 | v28.19,14.73 28.19,20.83 v24.08,24.94 | v10.52,23.88 2.44,15.8 2.44,15.04 PINS.2
LL  (via drill 0.35)
  Top 0.152: v11.43,30.12 9.91,28.6 8.84,28.6 R4.1.1 8.69,28.45 6.71,26.47 6.55,26.47 6.25,26.16 6.25,25.1 6.86,24.49 v22.71,24.49 | v20.73,32.41 21.49,32.41 21.79,32.72 R4.3.1 | v46.02,25.7 45.57,25.25 44.35,25.25 IC2.12 44.35,25.1 42.98,25.1 42.06,24.18 v34.9,24.18 | v44.5,31.19 44.2,31.5 44.04,31.5 43.13,32.41 43.13,35 43.89,35.76 44.35,35.76 IC3.14 44.5,35.92 44.96,35.92 45.72,36.68 | IC3.12 44.96,38.35 45.72,37.59 45.72,36.68 | R4.1 63.55,21.74 63.55,22.96 63.09,23.42 63.09,24.49 63.25,24.64 64.31,24.64 65.53,23.42 66.29,23.42 67.06,22.66 R9.1 67.21,22.66 67.21,20.07 67.51,19.76 | v64.62,11.23 65.23,10.62 65.23,10.16 R2.1 | v64.62,15.04 64.62,16.87 67.51,19.76 | 67.51,19.76 68.28,19.76 J1.SLEEVE 67.51,19.76 | 45.72,36.68 47.09,36.68 v48.92,34.85
  Bottom 0.152: v11.43,30.12 18.44,30.12 v20.73,32.41 | v46.02,25.7 46.02,27.23 44.5,28.75 v44.5,31.19 | v64.62,11.23 v64.62,15.04 64.62,27.23 57,34.85 v48.92,34.85 | v22.71,24.49 23.77,25.55 33.53,25.55 v34.9,24.18
N$1
  Top 0.152: 9.6,15.8 9.45,15.8 8.84,15.19 R1.9.2 | 9.6,15.8 12.19,15.8 12.5,15.49 12.5,15.34 ECG_1.9 | 9.6,15.8 7.16,18.24 R1.8.1
N$2
  Top 0.152: ECG_2.2 32.77,13.36 38.71,13.36 39.93,14.58 R2.3.2
N$3
  Top 0.152: ECG_1.2 14.94,12.9 19.2,12.9 20.73,14.43 21.64,14.43 R1.3.2
N$4
  Top 0.152: ECG_1.3 14.94,13.36 19.05,13.36 21.49,15.8 21.49,16.41 R1.4.2
N$5  (via drill 0.35)
  Top 0.152: v36.73,13.97 36.58,13.82 32.77,13.82 ECG_2.3 | v38.86,16.1 39.47,16.1 39.78,16.41 R2.4.2
  Bottom 0.152: v38.86,16.1 v36.73,13.97
N$6
  Top 0.152: C1.1.1 8.84,21.59 11.58,21.59 11.73,21.74 R1.7.1 12.65,22.5 14.33,22.5 14.48,22.35 14.48,20.98 16.46,19 16.46,18.69 R1.6.1
N$7
  Top 0.152: ECG_1.7 13.56,15.34 13.56,18.54 C1.3.1 13.56,18.69 13.56,21.74 R1.7.2
N$8
  Top 0.152: ECG_1.4 14.94,13.97 16.92,13.97 17.53,14.58 17.53,17.93 17.37,18.08 17.37,20.68 18.14,21.44 C1.2.1
N$9  (via drill 0.35)
  Top 0.152: v14.94,16.26 14.94,14.43 ECG_1.5 | v16.61,19.76 16.61,21.44 C1.2.2 16.61,21.59 17.37,22.35 18.75,22.35 19.2,21.89 21.49,21.89 R1.5.2
  Bottom 0.152: v14.94,16.26 14.94,16.87 16.61,18.54 v16.61,19.76
N$10
  Top 0.152: ECG_1.19 13.56,11.53 13.56,11.23 14.94,9.86 19.05,9.86 19.51,9.4 19.51,7.72 17.22,5.44 R1.13.1 17.22,5.28 17.98,4.52 22.25,4.52 22.86,5.13 22.86,18.39 22.1,19.15 21.03,19.15 20.57,18.69 18.29,18.69 R1.6.2
N$11  (via drill 0.35)
  Top 0.152: v16,16.41 15.54,16.87 14.63,16.87 14.02,16.26 14.02,15.34 ECG_1.6 | v18.14,16.41 18.14,15.49 18.44,15.19 C1.6.1 | v20.57,11.53 21.18,10.92 21.64,10.92 R1.12.2
  Bottom 0.152: v16,16.41 v18.14,16.41 20.57,13.97 v20.57,11.53
N$12
  Top 0.152: R1.14.2 8.99,5.44 10.67,5.44 11.58,6.35 13.11,6.35 13.87,5.59 C1.7.1 14.02,5.59 15.39,5.59 18.59,8.79 R1.10.2 18.59,8.94 17.98,9.55 14.78,9.55 13.11,11.23 13.11,11.53 ECG_1.18
N$13
  Top 0.152: 20.88,5.44 21.64,5.44 R1.11.2 | 20.88,5.44 18.9,5.44 R1.13.2 | 20.88,5.44 20.88,7.72 21.64,8.48 21.64,8.94 R1.12.1
N$14
  Top 0.152: ECG_1.20 14.02,11.53 16,11.53 16.46,11.07 17.68,11.07 18.59,11.99 C1.4.2 18.75,12.14 20.88,12.14 21.03,11.99 21.95,11.99 22.55,11.38 22.55,8.48 21.79,7.72 21.79,7.26 R1.11.1
N$15
  Top 0.152: ECG_1.1 14.94,12.29 16.61,12.29 16.76,12.14 C1.4.1
N$16
  Top 0.152: ECG_2.4 32.77,14.27 35.51,14.27 35.66,14.43 35.66,17.32 36.12,17.78 36.12,20.98 36.58,21.44 C2.2.1
N$17  (via drill 0.35)
  Top 0.152: v32.77,16.56 32.77,14.88 ECG_2.5 | v33.98,20.52 34.9,21.44 C2.2.2 35.05,21.59 35.81,22.35 37.19,22.35 37.64,21.89 39.78,21.89 R2.5.2
  Bottom 0.152: v32.77,16.56 32.77,19.3 v33.98,20.52
N$18
  Top 0.152: IC2.8 50.44,29.06 49.07,29.06 48.46,29.67 44.65,29.67 41.3,33.02 41.3,40.79 43.28,42.77 49.84,42.77 50.44,42.16 IC3.8
N$19
  Top 0.152: C2.1.1 29.57,21.44 29.87,21.74 R2.7.1 29.87,21.89 30.79,22.81 32.46,22.81 32.77,22.5 32.77,20.83 35.2,18.39 R2.6.1
N$20
  Top 0.152: ECG_2.7 31.39,15.65 31.39,18.24 31.55,18.39 C2.3.1 31.55,18.54 31.55,21.74 R2.7.2
N$21
  Top 0.152: 27.13,16.1 26.52,15.49 R2.9.2 | 27.13,16.1 27.28,16.26 30.02,16.26 30.33,15.95 30.33,15.65 ECG_2.9 | 27.13,16.1 24.84,18.39 R2.8.1
N$22
  Top 0.152: 35.36,5.74 35.2,5.59 R2.13.1 35.36,5.74 | 35.36,5.74 38.1,8.48 38.1,9.86 37.64,10.31 32.77,10.31 31.39,11.68 31.39,11.84 ECG_2.19 | 35.36,5.74 36.27,4.83 40.54,4.83 41.6,5.89 41.6,17.93 40.39,19.15 39.32,19.15 38.56,18.39 37.03,18.39 R2.6.2
N$23  (via drill 0.35)
  Top 0.152: v33.98,17.17 32.46,17.17 31.85,16.56 31.85,15.65 ECG_2.6 | v36.27,16.41 36.27,15.65 36.73,15.19 C2.6.1 36.88,15.19 37.19,15.49 40.54,15.49 40.69,15.34 40.69,12.29 40.08,11.68 40.08,11.23 R2.12.2
  Bottom 0.152: v33.98,17.17 35.51,17.17 v36.27,16.41
N$24
  Top 0.152: 39.17,5.74 39.93,5.74 R2.11.2 | 39.17,5.74 36.88,5.74 R2.13.2 | 39.17,5.74 39.17,8.03 39.93,8.79 39.93,9.25 R2.12.1
N$25  (via drill 0.35)
  Top 0.152: ECG_2.20 31.85,11.84 34.14,11.84 34.59,11.38 35.97,11.38 36.73,12.14 C2.4.2 36.88,12.14 38.25,10.77 v38.71,10.77 | v41,8.48 40.08,7.57 R2.11.1
  Bottom 0.152: v38.71,10.77 v41,8.48
N$26
  Top 0.152: ECG_2.1 32.77,12.75 34.59,12.75 35.05,12.29 C2.4.1
N$27
  Top 0.152: 32.46,8.33 32.46,6.5 31.85,5.89 C2.7.1 31.7,5.89 31.09,6.5 29.41,6.5 28.5,5.59 R2.14.2 | 32.46,8.33 32.46,9.7 30.94,11.23 30.94,11.84 ECG_2.18 | 32.46,8.33 35.81,8.33 36.58,9.09 36.88,9.09 R2.10.2
N$28
  Top 0.152: ECG_3.2 32.31,33.02 33.38,33.02 34.29,33.93 37.64,33.93 38.25,34.54 R3.3.2
N$29
  Top 0.152: ECG_3.3 32.31,33.48 33.38,33.48 34.14,34.24 36.27,34.24 38.25,36.22 R3.4.2
N$30  (via drill 0.35)
  Top 0.152: v32.92,36.83 32.92,34.39 32.46,33.93 32.31,33.93 ECG_3.4 | v35.51,39.42 35.51,40.94 C3.2.1
  Bottom 0.152: v35.51,39.42 v32.92,36.83
N$31  (via drill 0.35)
  Top 0.152: v32.31,37.59 32.31,34.54 ECG_3.5 | v33.98,39.27 33.98,40.94 C3.2.2 33.98,41.1 34.75,41.86 36.27,41.86 36.58,41.55 38.25,41.55 R3.5.2
  Bottom 0.152: v33.98,39.27 v32.31,37.59
N$32
  Top 0.152: C3.1.1 26.67,41.1 29.11,41.1 29.26,41.25 R3.7.1 29.26,41.4 30.18,42.32 31.85,42.32 32.16,42.01 32.16,40.03 33.98,38.2 R3.6.1
N$33
  Top 0.152: ECG_3.7 30.94,35.31 30.94,38.05 C3.3.1 30.94,38.2 30.94,41.25 R3.7.2
N$34
  Top 0.152: 27.13,35.61 26.52,35 R3.9.2 | 27.13,35.61 27.43,35.92 29.41,35.92 29.72,35.61 29.72,35.31 ECG_3.9 | 27.13,35.61 24.84,37.9 R3.8.1
N$35
  Top 0.152: ECG_3.19 30.94,31.5 30.94,31.19 31.55,30.58 36.27,30.58 36.73,30.12 36.73,28.75 34.29,26.31 R3.13.1 34.29,26.16 35.36,25.1 39.01,25.1 39.47,25.55 39.47,38.35 39.01,38.81 37.8,38.81 37.19,38.2 35.81,38.2 R3.6.2
N$36  (via drill 0.35)
  Top 0.152: v31.7,36.07 31.39,35.76 31.39,35.31 ECG_3.6 | v34.9,36.22 35.81,35.31 C3.6.1 35.97,35.31 37.8,37.13 39.01,37.13 39.17,36.98 39.17,32.26 38.41,31.5 38.41,31.19 R3.12.2
  Bottom 0.152: v31.7,36.07 34.75,36.07 v34.9,36.22
N$37
  Top 0.152: 37.64,26.01 36.12,26.01 35.97,26.16 R3.13.2 | 37.64,26.01 38.25,26.01 R3.11.2 | 37.64,26.01 37.64,28.45 38.25,29.06 38.25,29.36 R3.12.1
N$38
  Top 0.152: 35.81,32.26 34.9,31.34 33.68,31.34 33.53,31.5 31.39,31.5 ECG_3.20 | 35.81,32.26 37.8,30.28 39.01,30.28 39.17,30.12 39.17,28.75 38.41,27.99 38.41,27.69 R3.11.1 | 35.81,32.26 C3.4.2
N$39
  Top 0.152: ECG_3.1 32.31,32.41 33.98,32.41 C3.4.1
N$40
  Top 0.152: R3.14.2 26.52,26.01 28.5,26.01 28.96,25.55 30.48,25.55 31.24,26.31 C3.7.1 31.39,26.47 32.92,26.47 35.81,29.36 R3.10.2 35.81,29.51 35.05,30.28 31.39,30.28 30.33,31.34 ECG_3.18
N$41
  Top 0.152: ECG_4.2 15.24,32.41 19.81,32.41 21.79,34.39 R4.3.2
N$42
  Top 0.152: ECG_4.3 15.24,33.02 18.9,33.02 21.95,36.07 R4.4.2
N$43
  Top 0.152: ECG_4.4 15.24,33.48 15.54,33.48 16.61,34.54 16.61,35.76 18.29,37.44 18.29,40.18 19.05,40.94 C4.2.1
N$44
  Top 0.152: ECG_4.5 15.24,33.93 15.54,33.93 16,34.39 16,40.34 14.63,41.71 13.26,41.71 13.11,41.55 13.11,40.34 12.65,39.88 8.08,39.88 7.92,40.03 7.92,41.4 8.84,42.32 16.15,42.32 17.37,41.1 C4.2.2 17.53,41.1 18.29,41.86 19.81,41.86 20.27,41.4 21.79,41.4 R4.5.2
N$45
  Top 0.152: C4.1.1 8.84,40.79 12.04,40.79 12.19,40.94 R4.7.1 12.34,40.94 12.34,41.25 13.11,42.01 14.78,42.01 17.37,39.42 17.37,38.05 R4.6.1
N$46
  Top 0.152: ECG_4.7 13.87,34.85 13.87,37.44 14.02,37.59 C4.3.1 14.02,37.74 14.02,40.94 R4.7.2
N$47
  Top 0.152: 9.6,35.31 12.5,35.31 12.65,35.15 12.65,34.85 ECG_4.9 | 9.6,35.31 8.84,34.54 R4.9.2 | 9.6,35.31 9.45,35.31 7.01,37.74 R4.8.1
N$48  (via drill 0.35)
  Top 0.152: 19.81,28.75 18.75,29.82 14.78,29.82 13.87,30.73 13.87,31.04 ECG_4.19 | 19.81,28.75 19.81,27.69 18.59,26.47 18.14,26.47 17.37,25.7 R4.13.1 | v20.57,35.61 19.2,36.98 19.2,37.9 R4.6.2 | 19.81,28.75 v20.12,29.06
  Bottom 0.152: v20.57,35.61 27.28,35.61 29.26,33.63 29.26,31.19 27.74,29.67 20.73,29.67 v20.12,29.06
N$49  (via drill 0.35)
  Top 0.152: v15.39,34.7 14.33,34.7 ECG_4.6 | v18.14,33.63 19.05,34.54 C4.6.1 | v23.16,31.04 21.95,31.04 R4.12.2
  Bottom 0.152: v15.39,34.7 17.07,34.7 v18.14,33.63 18.59,34.09 26.98,34.09 28.96,32.11 28.96,31.34 28.65,31.04 v23.16,31.04
N$50
  Top 0.152: 21.18,25.7 21.79,25.7 R4.11.2 | 21.18,25.7 19.2,25.7 R4.13.2 | 21.18,25.7 21.18,28.14 21.79,28.75 21.79,29.21 R4.12.1
N$51
  Top 0.152: ECG_4.20 14.33,31.04 16.31,31.04 16.76,30.58 18.14,30.58 19.05,31.5 C4.4.2 19.2,31.5 20.57,30.12 22.55,30.12 22.71,29.97 22.71,28.75 21.95,27.99 21.95,27.53 R4.11.1
N$52
  Top 0.152: ECG_4.1 15.24,31.8 17.07,31.8 17.22,31.65 C4.4.1
N$53
  Top 0.152: R4.14.2 8.84,25.7 10.82,25.7 11.73,26.62 13.41,26.62 14.02,26.01 C4.7.1 14.17,26.01 16.31,26.01 17.68,27.38 18.14,27.38 18.9,28.14 R4.10.2 18.9,28.3 17.68,29.51 14.48,29.51 13.26,30.73 ECG_4.18
NEU  (via drill 0.35)
  Top 0.152: v24.08,39.73 21.95,39.73 R4.5.1 | v37.19,40.79 38.25,39.73 R3.5.1 | v23.47,22.5 23.47,22.35 21.64,20.52 21.64,20.22 R1.5.1 | v25.6,22.5 30.02,22.5 30.63,23.11 39.93,23.11 40.69,22.35 40.69,22.2 | 40.69,22.2 40.69,20.98 39.93,20.22 R2.5.1 | 40.69,22.2 42.67,22.2 42.82,22.05 45.41,22.05 45.57,21.89 48.16,21.89 49.38,20.68 51.66,20.68 52.43,19.91 58.98,19.91 J1.TIP
  Bottom 0.152: v24.08,39.73 24.54,39.73 25.6,40.79 v37.19,40.79 44.35,40.79 46.63,38.51 46.63,37.9 34.59,25.86 23.16,25.86 22.1,24.79 22.1,23.88 v23.47,22.5 v25.6,22.5
RA  (via drill 0.35)
  Top 0.152: 45.41,7.72 44.81,7.72 IC1.14 45.41,7.72 | 45.41,7.72 46.33,6.81 48.77,6.81 50.29,5.28 50.75,5.28 IC1.1 | 48.92,20.07 50.44,20.07 IC2.1 | 48.92,20.07 43.43,14.58 43.43,9.86 43.59,9.7 45.72,9.7 46.02,9.4 46.02,8.33 45.41,7.72 | R3.1 59.28,24.33 59.59,24.03 62.33,24.03 R8.1 62.48,24.03 62.48,26.62 68.12,32.26 | v65.68,33.17 64.77,33.17 R5.1 | v66.9,33.17 67.21,33.17 68.12,32.26 | 68.12,32.26 68.43,31.95 J2.SLEEVE 68.12,32.26 | v7.77,33.02 8.53,32.26 8.53,31.34 R4.2.1 | v20.73,37.29 21.18,37.29 21.79,37.9 R4.4.1 | v48.92,20.22 48.92,20.07
  Bottom 0.152: v66.9,33.17 v65.68,33.17 62.94,33.17 54.71,41.4 48.01,41.4 | v7.77,33.02 7.32,33.02 5.33,35 5.33,35.61 7.01,37.29 v20.73,37.29 24.84,41.4 48.01,41.4 | v48.92,20.22 48.92,24.03 48.01,24.94 48.01,41.4
RA+LA  (via drill 0.35)
  Top 0.152: 58.83,35.15 58.67,35.31 R6.2 58.83,35.15 | 58.83,35.15 60.66,33.32 63.4,33.32 R5.2 | v52.27,38.35 IC3.5 | 58.83,35.15 v58.83,36.37
  Bottom 0.152: v52.27,38.35 56.84,38.35 v58.83,36.37
RA+LL
  Top 0.152: R4.2 60.81,23.27 59.13,23.27 58.06,24.33 R3.2 57.91,24.49 57.3,25.1 50.6,25.1 IC2.5
REFOUT_1  (via drill 0.35)
  Top 0.152: ECG_1.8 12.95,15.34 v12.95,17.48 12.95,17.63 12.04,18.54 C1.3.2 11.89,18.54 11.73,18.39 8.84,18.39 R1.8.2 | v14.17,17.48 15.85,17.48 16.76,16.56 16.76,15.19 C1.6.2
  Bottom 0.152: v12.95,17.48 v14.17,17.48
REFOUT_2
  Top 0.152: ECG_2.8 30.79,15.65 30.79,17.48 29.87,18.39 C2.3.2 | R2.8.2 26.52,18.54 29.72,18.54 C2.3.2 | C2.6.2 34.9,15.19 34.9,17.17 32.46,19.61 32.46,22.35 32.31,22.5 30.94,22.5 30.79,22.35 30.79,19.46 29.87,18.54 C2.3.2
REFOUT_3
  Top 0.152: ECG_3.8 30.33,36.98 29.26,38.05 C3.3.2 | R3.8.2 26.52,38.05 29.11,38.05 C3.3.2 | C3.6.2 33.98,35.31 33.98,36.83 31.85,38.96 31.85,41.86 31.7,42.01 30.33,42.01 30.18,41.86 30.18,39.12 29.26,38.2 C3.3.2
REFOUT_4  (via drill 0.35)
  Top 0.152: ECG_4.8 13.26,36.83 12.5,37.59 C4.3.2 12.34,37.74 | 12.34,37.74 R4.8.2 | v18.9,36.22 17.37,34.7 C4.6.2 | v23.01,36.83 23.01,38.2 22.4,38.81 v20.12,38.81 | 12.34,37.74 v13.41,38.81
  Bottom 0.152: v18.9,36.22 22.4,36.22 v23.01,36.83 | v13.41,38.81 v20.12,38.81
S0  (via drill 0.35)
  Top 0.152: v45.87,28.3 45.41,27.84 44.35,27.84 IC2.10 | v46.02,40.79 44.5,40.79 IC3.10 | v46.33,13.97 45.26,12.9 44.81,12.9 IC1.10
  Bottom 0.152: 45.87,32.72 45.87,36.68 46.94,37.74 46.94,39.88 v46.02,40.79 | 45.87,32.72 v45.87,28.3 46.63,27.53 46.63,22.2 46.33,21.89 v46.33,13.97 | 45.87,32.72 43.13,32.72 41.76,31.34 41.76,30.12 32.46,20.83 32.46,18.08 28.5,14.12 27.89,14.12 27.58,14.43 23.77,14.43 9.14,29.06 9.14,29.97 8.84,30.28 2.44,30.28 PINS.8
S1  (via drill 0.35)
  Top 0.152: IC3.9 43.89,42.16 v41.91,40.18 41.76,40.03 41.76,33.02 44.81,29.97 51.21,29.97 51.82,29.36 51.82,28.6 51.51,28.3 49.38,28.3 48.77,28.91 v46.94,28.91 44.35,28.91 IC2.9 | v46.94,16.26 44.81,14.12 IC1.9 | v5.94,35.31 4.88,34.24 4.88,30.89 2.44,28.45 2.44,27.69 PINS.7
  Bottom 0.152: v46.94,28.91 v46.94,16.26 | v5.94,35.31 14.63,35.31 16.15,36.83 20.27,36.83 20.42,36.68 21.95,36.68 25.45,40.18 v41.91,40.18
SDN  (via drill 0.35)
  Top 0.152: v10.52,33.02 11.28,33.02 ECG_4.13 | v26.67,33.48 28.35,33.48 ECG_3.13 | ECG_1.13 11.12,13.36 3.35,13.36 2.44,12.45 PINS.1 2.44,12.29 2.44,9.55 R0.1 | v25.76,13.82 28.96,13.82 ECG_2.13 | v10.06,29.97 8.84,29.97 v8.53,29.67
  Bottom 0.152: v26.67,33.48 26.52,33.63 22.4,33.63 21.79,33.02 v10.52,33.02 10.52,30.43 v10.06,29.97 | v25.76,13.82 23.47,13.82 16.92,20.37 16.31,20.37 | 16.31,20.37 14.78,18.85 14.78,17.17 7.92,10.31 4.42,10.31 2.44,12.29 PINS.1 | v8.53,29.67 8.53,29.06 16.31,21.29 16.31,20.37
SIGNAL_1
  Top 0.152: ECG_1.10 12.04,15.19 10.36,15.19 9.45,14.27 7.92,14.27 7.16,15.04 R1.9.1 7.01,15.19 3.66,18.54 3.5,18.54 | 3.5,18.54 2.44,17.48 PINS.3 | 3.5,18.54 6.4,21.44 7.01,21.44 C1.1.2
SIGNAL_2  (via drill 0.35)
  Top 0.152: ECG_2.10 29.72,15.49 28.04,15.49 27.13,14.58 25.6,14.58 24.84,15.34 R2.9.1 24.69,15.49 23.93,16.26 23.93,19 24.69,19.76 v24.69,20.37 C2.1.2 | v20.57,22.81 v8.53,22.81
  Bottom 0.152: v8.53,22.81 5.79,20.07 2.44,20.07 PINS.4 | v20.57,22.81 22.25,22.81 v24.69,20.37
SIGNAL_3  (via drill 0.35)
  Top 0.152: v28.5,35.31 29.26,35.31 ECG_3.10 | v25.6,36.22 25.6,35.92 25.45,35.76 | 25.45,35.76 24.69,35 R3.9.1 24.54,34.85 23.01,33.32 v23.01,32.41 | 25.45,35.76 23.93,37.29 23.93,38.66 24.69,39.42 24.69,40.94 C3.1.2 | v11.58,27.53 v10.36,26.31
  Bottom 0.152: v28.5,35.31 28.04,35.31 27.13,36.22 v25.6,36.22 | v10.36,26.31 6.71,22.66 2.44,22.66 PINS.5 | v11.58,27.53 17.68,27.53 22.55,32.41 v23.01,32.41
SIGNAL_4
  Top 0.152: ECG_4.10 12.19,34.7 10.36,34.7 9.3,33.63 7.92,33.63 7.16,34.39 R4.9.1 | C4.1.2 7.01,40.64 7.01,39.27 6.1,38.35 6.1,36.07 7.01,35.15 7.01,34.54 R4.9.1 | PINS.6 2.44,25.1 2.44,26.01 5.18,28.75 5.18,32.56 7.01,34.39 R4.9.1
V1
  Top 0.152: IC1.15 47.85,6.5 50.6,3.76 62.18,3.76 67.67,9.25 68.43,9.25 J3.SLEEVE
V2  (via drill 0.35)
  Top 0.152: v47.55,19.61 45.87,21.29 44.35,21.29 IC2.15 | v58.67,2.54 66.6,2.54 J3.RING
  Bottom 0.152: v47.55,19.61 47.55,13.67 v58.67,2.54
V3  (via drill 0.35)
  Top 0.152: IC3.15 45.26,34.54 v49.23,30.58 | v57.61,10.92 59.13,9.4 J3.TIP
  Bottom 0.152: v49.23,30.58 49.23,30.28 57.61,21.89 v57.61,10.92
V4
  Top 0.152: IC1.11 44.81,11.68 46.63,11.68 49.68,14.73 53.34,14.73 54.71,13.36 63.4,13.36 65.38,11.38 67.51,11.38 68.43,12.29 68.43,14.58 69.65,15.8 69.65,22.5 68.58,23.57 68.58,26.47 69.8,27.69 69.8,33.32 68.43,34.7 68.43,37.44 69.49,38.51 69.49,41.86 68.58,42.77 J4.SLEEVE
V5
  Top 0.152: IC2.11 44.35,26.31 48.92,26.31 49.38,25.86 60.96,25.86 66.29,31.19 66.29,35.76 66.45,35.92 J4.RING
V6
  Top 0.152: IC3.11 44.5,39.73 48.92,39.73 49.53,40.34 56.69,40.34 59.13,42.77 J4.TIP
WCT  (via drill 0.35)
  Top 0.152: IC3.4 50.6,36.98 51.21,36.98 51.82,36.37 51.82,35.31 51.05,34.54 IC3.2 50.14,34.54 v48.62,33.02 | IC1.2 51.36,6.5 52.12,7.26 52.12,8.18 51.51,8.79 | 51.51,8.79 51.36,8.94 50.9,8.94 IC1.4 51.51,8.79 | 64.92,22.66 R9.2 | 64.92,22.66 63.7,23.88 R8.2 | 52.43,22.5 52.12,22.5 51.51,21.89 | 52.43,22.5 57.91,22.5 R7.2 58.06,22.5 58.83,21.74 59.89,21.74 60.66,20.98 64.01,20.98 64.92,21.89 64.92,22.66 | 51.51,21.89 51.05,21.44 50.6,21.44 IC2.2 | 52.43,22.5 51.05,23.88 50.6,23.88 IC2.4 | v52.43,9.7 51.51,8.79 | 51.51,21.89 v52.43,20.98
  Bottom 0.152: v52.43,9.7 v52.43,20.98 48.62,24.79 v48.62,33.02